# EAGLE schematic UpTo11.MotherBoard (EAGLE 9.6.2)
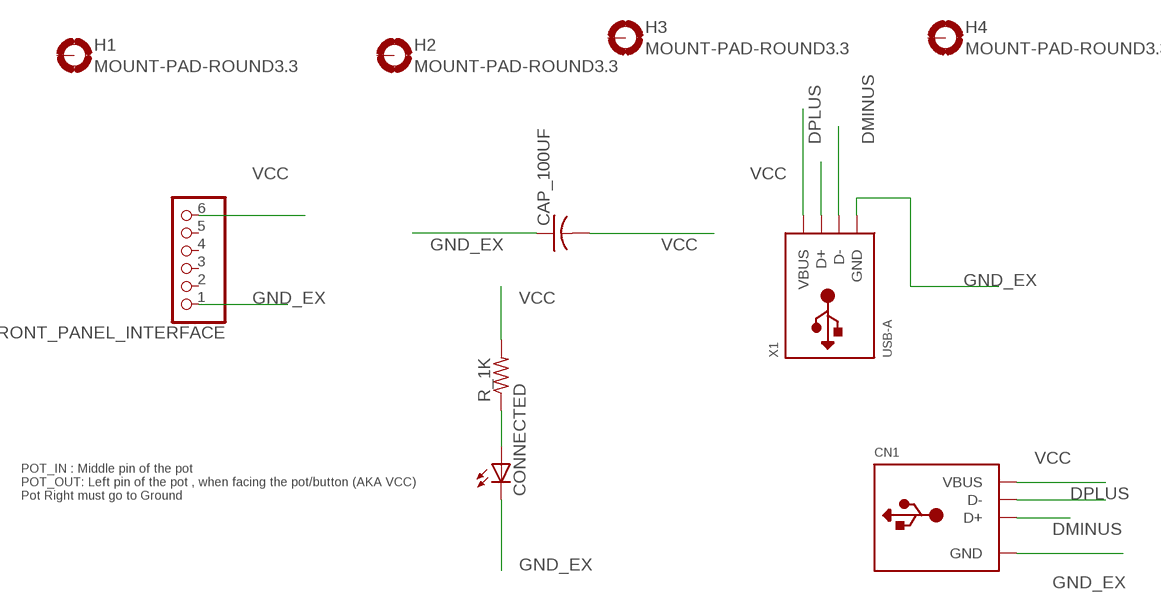
[diagram p0: schematic, sheet 1]

## Parts
CAP_100UF  C-US025-030X050  [C025-030X050]
CN1  USB_TYPEAPTHFML  [USB_HOST-PTH]
CONNECTED  LEDSMT1206  [1206]
FRONT_PANEL_INTERFACE  PINHD-1X6  [1X06]
H1  MOUNT-PAD-ROUND3.3  [3,3-PAD]
H2  MOUNT-PAD-ROUND3.3  [3,3-PAD]
H3  MOUNT-PAD-ROUND3.3  [3,3-PAD]
H4  MOUNT-PAD-ROUND3.3  [3,3-PAD]
R_1K  R-US_R1206  [R1206]
X1  USB-A  [MOLEX_480371000]

## Nets
DMINUS: CN1.D+ X1.2(D-)
DPLUS: CN1.D- X1.3(D+)
GND_EX: CAP_100UF.1 CN1.GND CONNECTED.C FRONT_PANEL_INTERFACE.1 X1.4(GND)
N$1: CONNECTED.A R_1K.1
VCC: CAP_100UF.2 CN1.VBUS FRONT_PANEL_INTERFACE.6 R_1K.2 X1.1(VBUS)
Unconnected: FRONT_PANEL_INTERFACE.2 FRONT_PANEL_INTERFACE.3 FRONT_PANEL_INTERFACE.4 FRONT_PANEL_INTERFACE.5 H1.B3,3(MOUNT) H2.B3,3(MOUNT) H3.B3,3(MOUNT) H4.B3,3(MOUNT)

## Notes on the sheet
- POT_IN : Middle pin of the pot
  POT_OUT: Left pin of the pot , when facing the pot/button (AKA VCC)
  Pot Right must go to Ground

## Library data of the parts
CAP_100UF = adafruit:C-US: CAPACITOR, American symbol
CN1 = microbuilder:USB_TYPEA: USB - Type A Connectors Male types stick out and are inserted into a PC or matching females parts (these are the connectors used on USB Memory Sticks, etc.). Female parts are generally used for USB Host and accept a male-type connector. SMT Male - 4UCON: 10017 PTH Female - Digikey: 609-1045-ND, 4UCon: 05241
CONNECTED = adafruit:LED: LED OSRAM: - CHIPLED LG R971, LG N971, LY N971, LG Q971, LY Q971, LO R971, LY R971 LH N974, LH R974 LS Q976, LO Q976, LY Q976 LO Q996 - Hyper CHIPLED LW Q18S LB Q993, LB Q99A, LB R99A - SideLED LS A670, LO A670, LY A670, LG A670, LP A670 LB A673, LV A673, LT A673, LW A673 LH A674 LY A675 LS A676, LA A676, LO A676, LY A676, LW A676 LS A679, LY A679, LG A679 - Hyper Micro SIDELED® LS Y876, LA Y876, LO Y876, LY Y876 LT Y87S - SmartLED LW L88C, LW L88S LB L89C, LB L89S, LG L890 LS L89K, LO L89K, LY L89K LS L896, LA L896, LO L896, LY L896 - TOPLED LS T670, LO T670, LY T670, LG T670, LP T670 LSG T670, LSP T670, LSY T670, LOP T670, LYG T670 LG T671, LOG T671, LSG T671 LB T673, LV T673, LT T673, LW T673 LH T674 LS T676, LA T676, LO T676, LY T676, LB T676, LH T676, LSB T676, LW T676 LB T67C, LV T67C, LT T67C, LS T67K, LO T67K, LY T67K, LW E67C LS E67B, LA E67B, LO E67B, LY E67B, LB E67C, LV E67C, LT E67C LW T67C LS T679, LY T679, LG T679 LS T770, LO T770, LY T770, LG T770, LP T770 LB T773, LV T773, LT T773, LW T773 LH T774 LS E675, LA E675, LY E675, LS T675 LS T776, LA T776, LO T776, LY T776, LB T776 LHGB T686 LT T68C, LB T68C - Hyper Mini TOPLED® LB M676 - Mini TOPLED Santana® LG M470 LS M47K, LO M47K, LY M47K Source: http://www.osram.convergy.de/
FRONT_PANEL_INTERFACE = adafruit:PINHD-1X6: PIN HEADER
H1-H4 = holes:MOUNT-PAD-ROUND: MOUNTING PAD, round
R_1K = adafruit:R-US_: RESISTOR, American symbol
X1 = adafruit:USB-A: USB type A 'plug' Used for things that can directly connect to a USB port, say USB key